# EAGLE schematic rpibout (EAGLE 7.7.0)
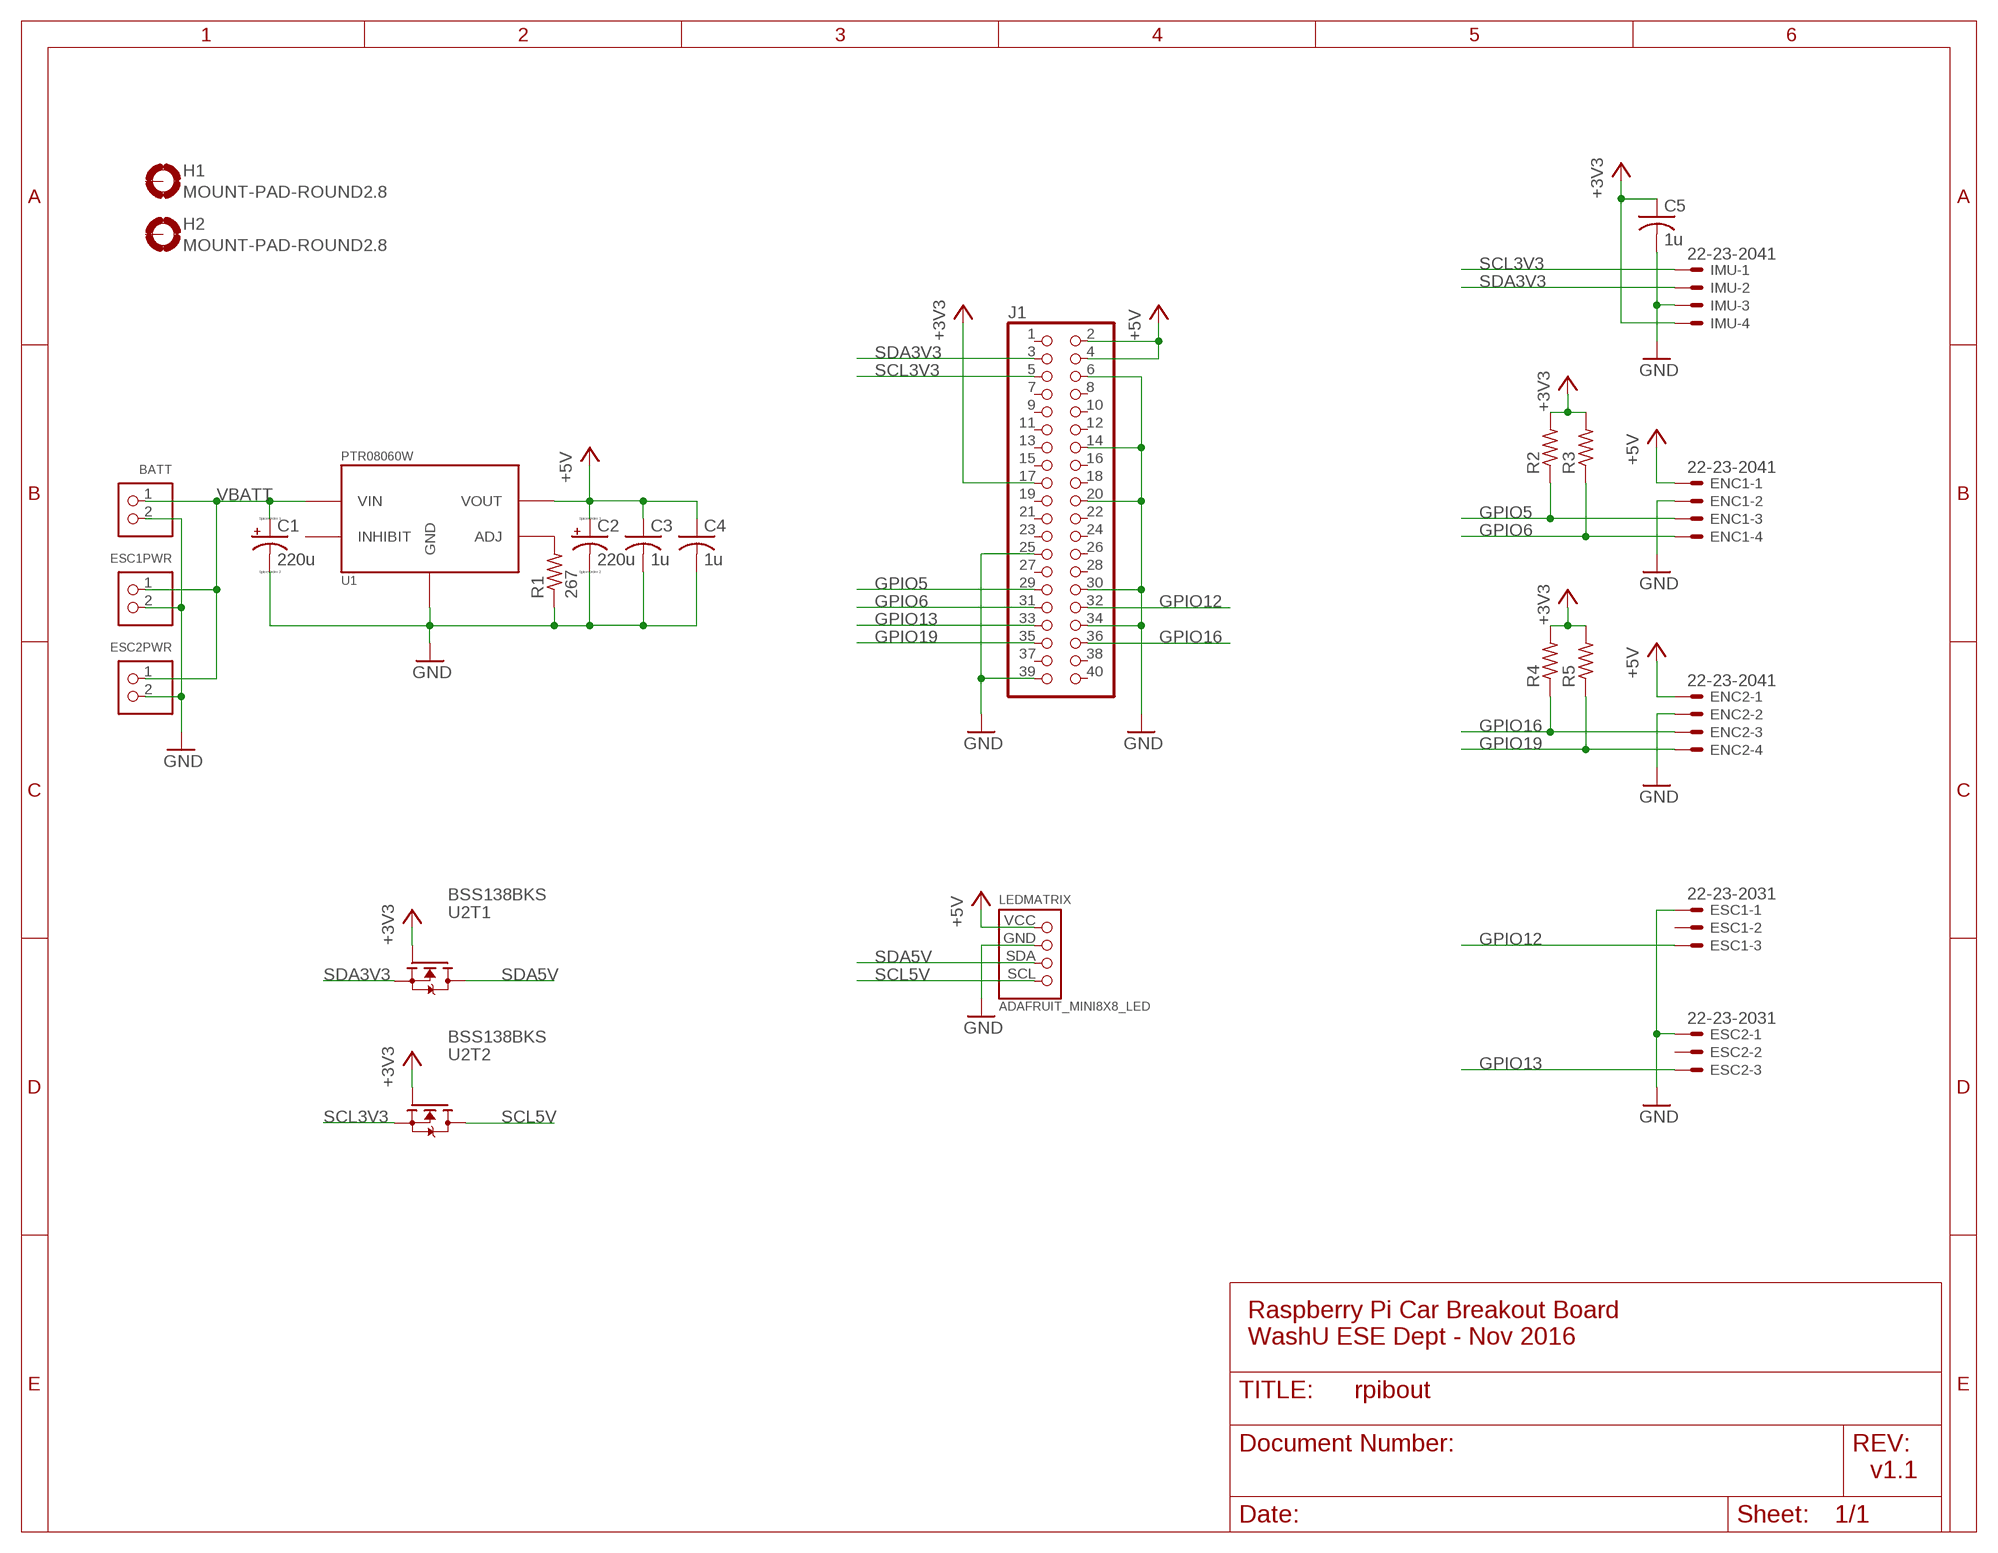
[diagram p0: schematic, sheet 1]

## Parts
BATT  ULTRAFIT_2CIRC  [ULTRAFIT_2CIRC_RANGLE]
C1  220u  CPOL-USE3.5-8  [E3,5-8]
C2  220u  CPOL-USE3.5-8  [E3,5-8]
C3  1u  C-USC1206  [C1206]
C4  1u  C-USC1206  [C1206]
C5  1u  C-USC1206  [C1206]
ENC1  22-23-2041  [22-23-2041]
ENC2  22-23-2041  [22-23-2041]
ESC1  22-23-2031  [22-23-2031]
ESC1PWR  ULTRAFIT_2CIRC  [ULTRAFIT_2CIRC_RANGLE]
ESC2  22-23-2031  [22-23-2031]
ESC2PWR  ULTRAFIT_2CIRC  [ULTRAFIT_2CIRC_RANGLE]
H1  MOUNT-PAD-ROUND2.8  [2,8-PAD]
H2  MOUNT-PAD-ROUND2.8  [2,8-PAD]
IMU  22-23-2041  [22-23-2041]
J1  PINHD-2X20  [2X20]
LEDMATRIX  ADAFRUIT_MINI8X8_LED  [ADAFRUIT_MINI8X8_BACKPACK]
R1  267  R-US_R1206  [R1206]
R2  R-US_R1206  [R1206]
R3  R-US_R1206  [R1206]
R4  R-US_R1206  [R1206]
R5  R-US_R1206  [R1206]
U1  PTR08060W  [EDP_MODULE]
U2  BSS138BKS  [SOT363]

## Nets
+3V3: C5.1 IMU.4 J1.17 R2.2 R3.2 R4.2 R5.2 U2.2(T1:G) U2.5(T2:G)
+5V: C2.+ C3.1 C4.1 ENC1.1 ENC2.1 J1.2 J1.4 LEDMATRIX.VCC U1.P4(VOUT)
GND: BATT.2 C1.- C2.- C3.2 C4.2 C5.2 ENC1.2 ENC2.2 ESC1.1 ESC1PWR.2 ESC2.1 ESC2PWR.2 IMU.3 J1.6 J1.14 J1.20 J1.25 J1.30 J1.34 J1.39 LEDMATRIX.GND R1.1 U1.P3(GND)
GPIO5: ENC1.3 J1.29 R2.1
GPIO6: ENC1.4 J1.31 R3.1
GPIO12: ESC1.3 J1.32
GPIO13: ESC2.3 J1.33
GPIO16: ENC2.3 J1.36 R4.1
GPIO19: ENC2.4 J1.35 R5.1
N$2: R1.2 U1.P5(ADJ)
SCL3V3: IMU.1 J1.5 U2.4(T2:S)
SCL5V: LEDMATRIX.SCL U2.3(T2:D)
SDA3V3: IMU.2 J1.3 U2.1(T1:S)
SDA5V: LEDMATRIX.SDA U2.6(T1:D)
VBATT: BATT.1 C1.+ ESC1PWR.1 ESC2PWR.1 U1.P2(VIN)
Unconnected: ESC1.2 ESC2.2 H1.B2,8(MOUNT) H2.B2,8(MOUNT) J1.1 J1.7 J1.8 J1.9 J1.10 J1.11 J1.12 J1.13 J1.15 J1.16 J1.18 J1.19 J1.21 J1.22 J1.23 J1.24 J1.26 J1.27 J1.28 J1.37 J1.38 J1.40 U1.P1(INHIBIT)

## Notes on the sheet
- Raspberry Pi Car Breakout Board
  WashU ESE Dept - Nov 2016
- v1.1

## Library data of the parts
BATT ESC1PWR ESC2PWR = rpibout:ULTRAFIT_2CIRC: Molex Ultra-Fit Right Angle Header, 3.50mm Pitch, Single Row, 2 Circuits
C1 C2 = resistor:CPOL-US: POLARIZED CAPACITOR, American symbol
C3-C5 = resistor:C-US: CAPACITOR, American symbol
ENC1 ENC2 IMU = con-molex:22-23-2041: .100" (2.54mm) Center Header - 4 Pin; MF: MOLEX; MPN: 22-23-2041; OC_FARNELL: 1462920; OC_NEWARK: 38C0355
ESC1 ESC2 = con-molex:22-23-2031: .100" (2.54mm) Center Header - 3 Pin; MF: MOLEX; MPN: 22-23-2031; OC_FARNELL: 1462950; OC_NEWARK: 30C0862
H1 H2 = holes:MOUNT-PAD-ROUND: MOUNTING PAD, round
J1 = pinhead:PINHD-2X20: PIN HEADER
LEDMATRIX = rpibout:ADAFRUIT_MINI8X8_LED: Adafruit Mini 8x8 LED Matrix Backpack
R1-R5 = resistor:R-US_: RESISTOR, American symbol
U1 = rpibout:PTR08060W: PTR08060W Texas Instruments Buck Power Module
U2 = rpibout:BSS138BKS: BSS138BKS Dual N-MOSFET